# EAGLE design e-programmer (EAGLE 6.1)
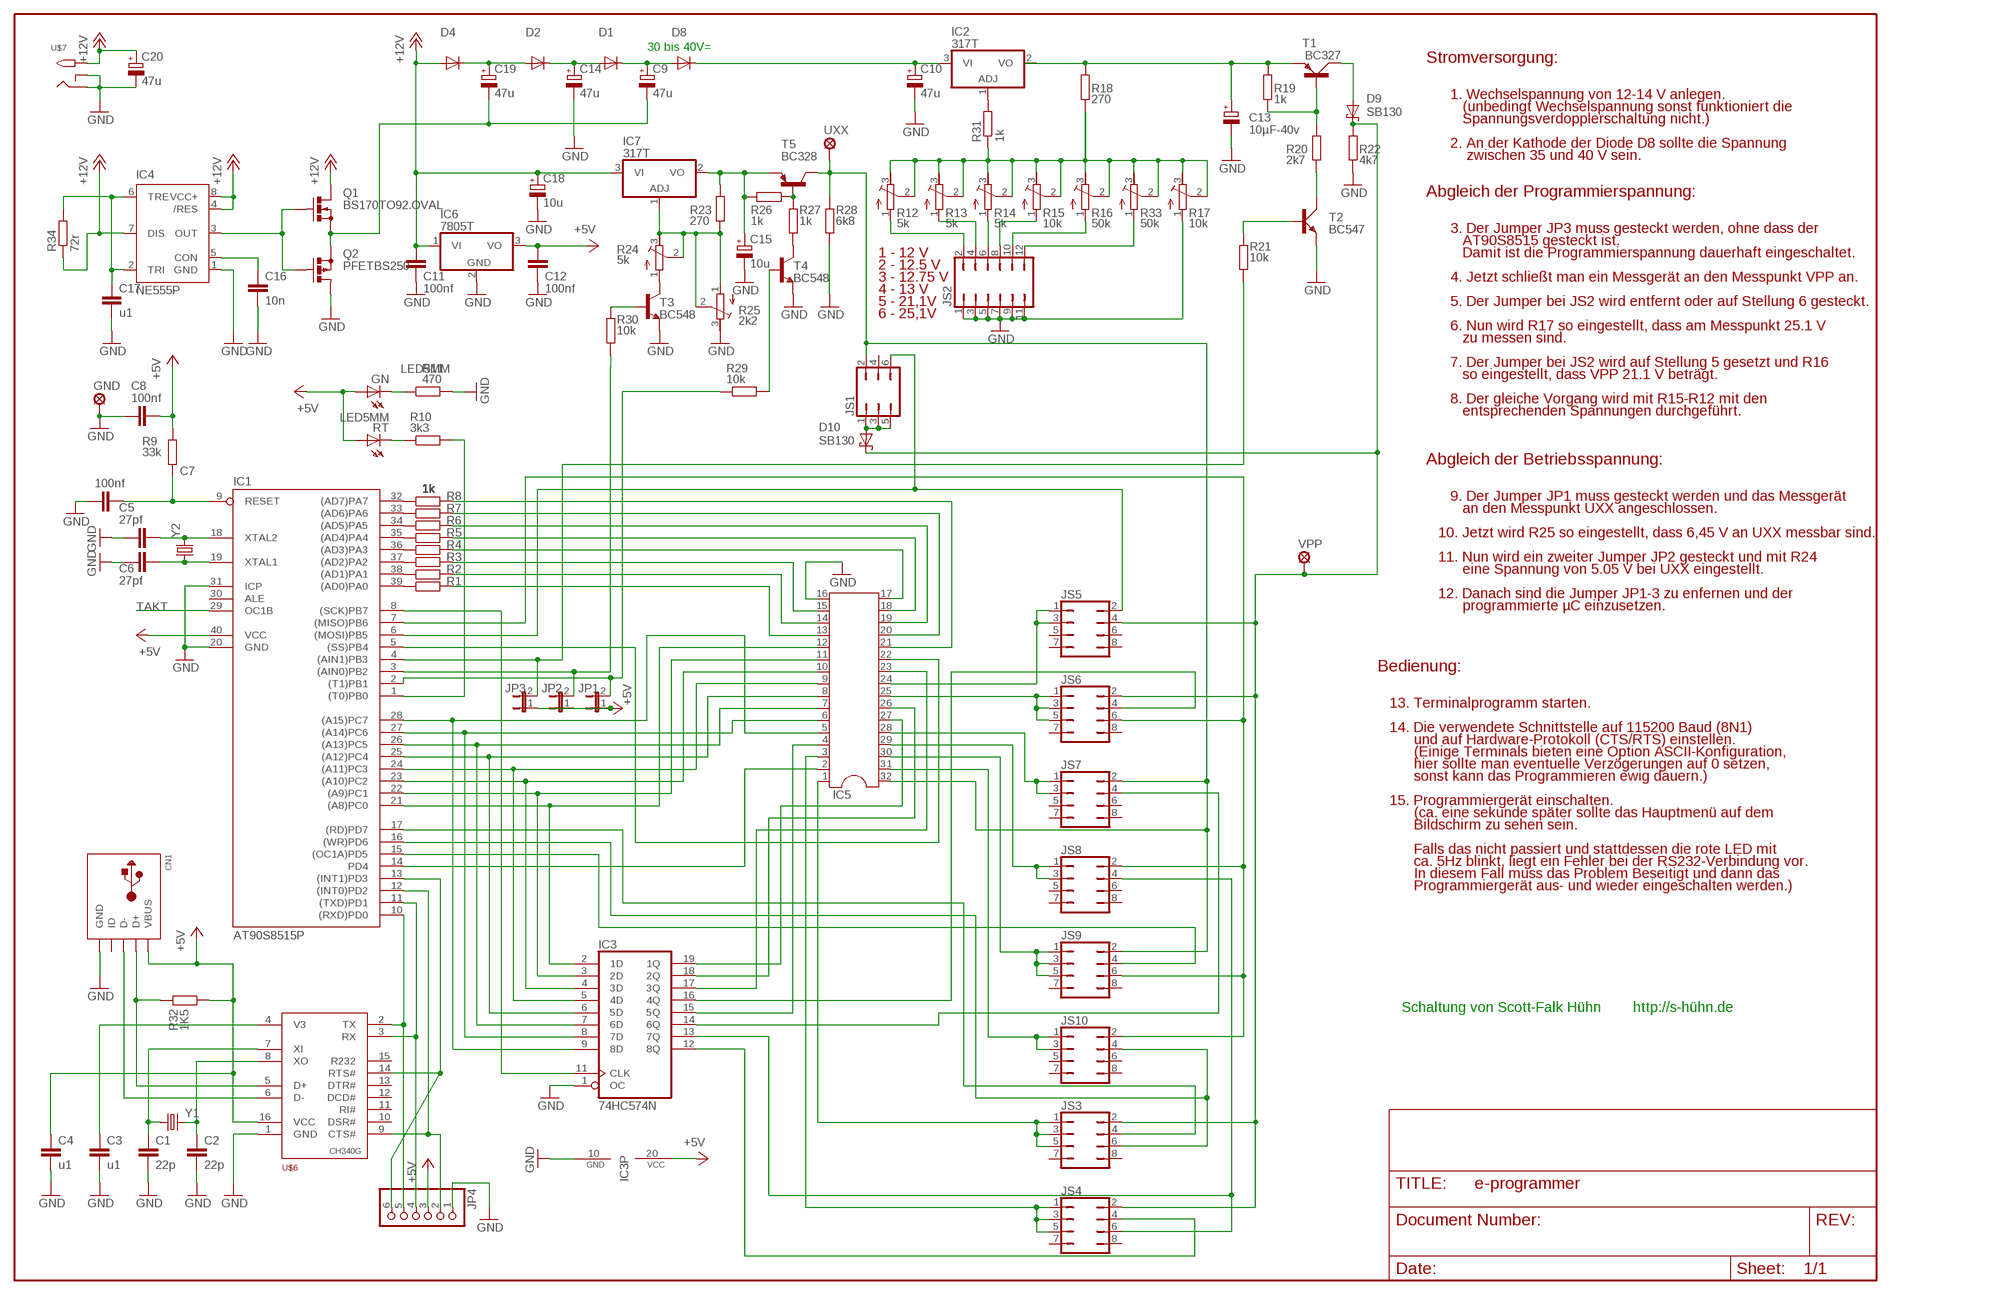
[diagram p0: schematic, sheet 1]

## Parts
C1  22p  C-EU025-025X050  [C025-025X050]
C2  22p  C-EU025-025X050  [C025-025X050]
C3  u1  C-EU025-025X050  [C025-025X050]
C4  u1  C-EU025-025X050  [C025-025X050]
C5  27pf  C-EU025-024X044  [C025-024X044]
C6  27pf  C-EU025-024X044  [C025-024X044]
C7  100nf  C-EU025-024X044  [C025-024X044]
C8  100nf  C-EU025-024X044  [C025-024X044]
C9  47u  CPOL-EUE2.5-7  [E2,5-7]
C10  47u  CPOL-EUE2.5-7  [E2,5-7]
C11  100nf  C-EU025-024X044  [C025-024X044]
C12  100nf  C-EU025-024X044  [C025-024X044]
C13  10µF-40v  CPOL-EUE2.5-5  [E2,5-5]
C14  47u  CPOL-EUE2.5-7  [E2,5-7]
C15  10u  CPOL-EUE2.5-7  [E2,5-7]
C16  10n  C-EU025-025X050  [C025-025X050]
C17  u1  C-EU025-025X050  [C025-025X050]
C18  10u  CPOL-EUE2.5-7  [E2,5-7]
C19  47u  CPOL-EUE2.5-7  [E2,5-7]
C20  47u  CPOL-EUE2.5-7  [E2,5-7]
CN1  USBTHM  [USB-MINIB-THM]
D1  1N4004  DIODE-DO35-10  [DO35-10]
D2  1N4004  DIODE-DO35-10  [DO35-10]
D4  1N4004  DIODE-DO35-10  [DO35-10]
D8  1N4004  DIODE-DO35-10  [DO35-10]
D9  SB130  SCHOTTKY-DIODEDO35-7  [DO35-7]
D10  SB130  SCHOTTKY-DIODEDO35-7  [DO35-7]
GN  LED5MM  [LED5MM]
GND  LSP10  [LSP10]
IC1  AT90S8515P  [DIL40]
IC2  317T  [TO220H]
IC3  74HC574N  [DIL20]
IC4  NE555P  [DIL-08]
IC5  DIL32  [DIL32]
IC6  7805T  [TO220H]
IC7  317T  [TO220H]
JP1  JP1E  [JP1]
JP2  JP1E  [JP1]
JP3  JP1E  [JP1]
JP4  PINHD-1X6  [1X06]
JS1  JP3Q  [JP3Q]
JS2  JP6Q  [JP6Q]
JS3  JP4Q  [JP4Q]
JS4  JP4Q  [JP4Q]
JS5  JP4Q  [JP4Q]
JS6  JP4Q  [JP4Q]
JS7  JP4Q  [JP4Q]
JS8  JP4Q  [JP4Q]
JS9  JP4Q  [JP4Q]
JS10  JP4Q  [JP4Q]
Q1  BS170TO92.OVAL  [TO92-OVAL]
Q2  PFETBS250  [TO92-OVAL]
R1  1k  R-EU_0207/7  [0207/7]
R2  1k  R-EU_0207/7  [0207/7]
R3  1k  R-EU_0207/7  [0207/7]
R4  1k  R-EU_0207/7  [0207/7]
R5  1k  R-EU_0207/7  [0207/7]
R6  1k  R-EU_0207/7  [0207/7]
R7  1k  R-EU_0207/7  [0207/7]
R8  1k  R-EU_0207/7  [0207/7]
R9  33k  R-EU_0204/7  [0204/7]
R10  3k3  R-EU_0204/7  [0204/7]
R11  470  R-EU_0204/7  [0204/7]
R12  5k  R-TRIMM3296W  [RTRIM3296W]
R13  5k  R-TRIMM3296W  [RTRIM3296W]
R14  5k  R-TRIMM3296W  [RTRIM3296W]
R15  10k  R-TRIMM3296W  [RTRIM3296W]
R16  50k  R-TRIMM3296W  [RTRIM3296W]
R17  10k  R-TRIMM3296W  [RTRIM3296W]
R18  270  R-EU_0207/7  [0207/7]
R19  1k  R-EU_0207/7  [0207/7]
R20  2k7  R-EU_0207/7  [0207/7]
R21  10k  R-EU_0207/7  [0207/7]
R22  4k7  R-EU_0207/7  [0207/7]
R23  270  R-EU_0207/7  [0207/7]
R24  5k  R-TRIMM3296W  [RTRIM3296W]
R25  2k2  R-TRIMM3296W  [RTRIM3296W]
R26  1k  R-EU_0207/7  [0207/7]
R27  1k  R-EU_0207/7  [0207/7]
R28  6k8  R-EU_0207/7  [0207/7]
R29  10k  R-EU_0207/7  [0207/7]
R30  10k  R-EU_0207/7  [0207/7]
R31  1k  R-EU_0207/7  [0207/7]
R32  1K5  R-EU_0204/7  [0204/7]
R33  50k  R-TRIMM3296W  [RTRIM3296W]
R34  72r  R-EU_0204/7  [0204/7]
RT  LED5MM  [LED5MM]
T1  BC327  [SOT54A]
T2  BC547  [SOT54A]
T3  BC548  BC547  [TO92]
T4  BC548  BC547  [TO92]
T5  BC328  BC327  [TO92]
U$6  CH340G  [SO16]
U$7  2.1MMJACKTHM  [PJ-102A]
UXX  LSP10  [LSP10]
VPP  LSP10  [LSP10]
Y1  CRYSTALHC49US  [HC49US]
Y2  CRYSTALHC49US  [HC49US]

## Nets
!CE: IC1.5((SS)PB4) IC5.22
!OE: IC1.6((MOSI)PB5) JS1.6 JS5.2
!PR: IC1.7((MISO)PB6) JS6.6 JS8.2 JS9.6 JS10.2
+5V: C4.1 C8.2 C12.1 CN1.VBUS GN.A IC1.40(VCC) IC3.20(VCC) IC6.3(VO) JP1.1 JP2.1 JP3.1 JP4.3 R9.2 R32.1 RT.A U$6.16(VCC)
+12V: C11.1 C18.+ C20.+ D4.A IC4.4(/RES) IC4.7(DIS) IC4.8(VCC+) IC6.1(VI) IC7.3(VI) Q1.1(D) R34.1 U$7.TIP
A0: IC1.21((A8)PC0) IC3.2(1D) IC5.12
A1: IC1.22((A9)PC1) IC3.3(2D) IC5.11
A2: IC1.23((A10)PC2) IC3.4(3D) IC5.10
A3: IC1.24((A11)PC3) IC3.5(4D) IC5.9
A4: IC1.25((A12)PC4) IC3.6(5D) IC5.8
A5: IC1.26((A13)PC5) IC3.7(6D) IC5.7
A6: IC1.27((A14)PC6) IC3.8(7D) IC5.6
A7: IC1.28((A15)PC7) IC3.9(8D) IC5.5
A8: IC3.19(1Q) IC5.27
A9: IC3.18(2Q) IC5.26
A10: IC3.17(3Q) IC5.23
A11: IC3.16(4Q) JS6.4
A12: IC3.15(5Q) IC5.4
A13: IC3.14(6Q) JS7.4
A14: IC3.13(7Q) JS4.6 JS8.4
A15: IC3.12(8Q) JS4.4
A16: IC1.14(PD4) IC5.2
A17: IC1.15((OC1A)PD5) JS9.4
A18: IC1.16((WR)PD6) JS3.6 JS10.4
A19: IC1.17((RD)PD7) JS3.4
CTS: IC1.12((INT0)PD2) JP4.2 U$6.9(CTS#)
D0: IC5.13 R1.2
D1: IC5.14 R2.2
D2: IC5.15 R3.2
D3: IC5.17 R4.2
D4: IC5.18 R5.2
D5: IC5.19 R6.2
D6: IC5.20 R7.2
D7: IC5.21 R8.2
GND: C1.2 C2.2 C3.2 C4.2 C5.1 C6.1 C7.1 C8.1 C10.- C11.2 C12.2 C13.- C14.- C15.- C16.2 C17.2 C18.- C20.- CN1.GND GND.MP IC1.20(GND) IC1.31(ICP) IC3.1(OC) IC3.10(GND) IC4.1(GND) IC5.16 IC6.2(GND) JP4.1 JS2.1 JS2.3 JS2.5 JS2.7 JS2.9 JS2.11 Q2.1(D) R11.2 R17.1(E) R22.1 R25.3(A) R28.1 T2.E T3.1(E) T4.1(E) U$6.1(GND) U$7.RING U$7.RING_SW
N$1: IC1.32((AD7)PA7) R8.1
N$2: IC1.33((AD6)PA6) R7.1
N$3: IC1.34((AD5)PA5) R6.1
N$4: IC1.35((AD4)PA4) R5.1
N$5: IC1.36((AD3)PA3) R4.1
N$6: IC1.37((AD2)PA2) R3.1
N$7: IC1.38((AD1)PA1) R2.1
N$8: IC1.39((AD0)PA0) R1.1
N$9: IC1.8((SCK)PB7) IC3.11(CLK)
N$10: IC1.10((RXD)PD0) JP4.5 U$6.2(TX)
N$11: IC1.11((TXD)PD1) JP4.4 U$6.3(RX)
N$12: CN1.D+ R32.2 U$6.5(D+)
N$13: CN1.D- U$6.6(D-)
N$14: C2.1 U$6.8(XO) Y1.2
N$15: C1.1 U$6.7(XI) Y1.1
N$16: C3.1 U$6.4(V3)
N$17: JS2.12 R33.1(E)
N$18: C10.+ D8.C IC2.3(VI)
N$19: R10.1 RT.K(C)
N$20: C16.1 IC4.5(CON)
N$21: IC4.3(OUT) Q1.2(G) Q2.2(G)
N$22: C17.1 IC4.2(TRI) IC4.6(TRE) R34.2
N$23: C14.+ D1.A D2.C
N$24: C9.- C19.- Q1.3(S) Q2.3(S)
N$25: C9.+ D1.C D8.A
N$26: GN.K(C) R11.1
N$27: IC5.3 JS4.1 JS4.3 JS4.5
N$28: C5.2 IC1.18(XTAL2) Y2.2
N$29: C6.2 IC1.19(XTAL1) Y2.1
N$30: IC5.1 JS3.1 JS3.3 JS3.5
N$31: IC5.24 JS5.1 JS5.3
N$32: C7.2 IC1.9(RESET) R9.1
N$34: IC5.25 JS6.1 JS6.3 JS6.5
N$35: JS2.2 R12.1(E)
N$36: JS2.4 R13.1(E)
N$37: IC5.28 JS7.1 JS7.3
N$38: IC5.29 JS8.1 JS8.3
N$41: IC1.1((T0)PB0) R10.2
N$42: IC5.30 JS9.1 JS9.3 JS9.5
N$44: JS2.6 R14.1(E)
N$45: IC5.31 JS10.1 JS10.3
N$47: JS2.8 R15.1(E)
N$48: JS2.10 R16.1(E)
N$49: R12.2(S) R12.3(A) R13.2(S) R13.3(A) R14.2(S) R14.3(A) R15.2(S) R15.3(A) R16.2(S) R16.3(A) R17.2(S) R17.3(A) R18.1 R31.1 R33.2(S) R33.3(A)
N$50: D10.A JS1.1 JS1.3 JS1.5
N$51: D9.A T1.C
N$52: R26.1 R27.2 T5.2(B)
N$53: R27.1 T4.3(C)
N$55: IC7.1(ADJ) R23.1 R24.2(S) R24.3(A) R25.1(E) R25.2(S)
N$56: R24.1(E) T3.3(C)
N$57: C15.+ IC7.2(VO) R23.2 R26.2 T5.1(E)
N$60: R29.2 T4.2(B)
N$61: C13.+ IC2.2(VO) R18.2 R19.2 T1.E
N$62: R30.2 T3.2(B)
N$65: C19.+ D2.A D4.C
N$68: R19.1 R20.2 T1.B
N$69: R20.1 T2.C
N$70: R21.2 T2.B
N$71: IC2.1(ADJ) R31.2
RTS: IC1.13((INT1)PD3) JP4.6 U$6.14(RTS#)
TAKT: IC1.29(OC1B)
UXX: IC5.32 JS1.2 JS7.2 JS9.2 R28.2 T5.3(C) UXX.MP
VCC_5/6: IC1.3((AIN0)PB2) JP2.2 R30.1
VCC_EIN: IC1.2((T1)PB1) JP1.2 R29.1
VPP: D9.C D10.C JS3.2 JS4.2 JS5.4 JS6.2 R22.2 VPP.MP
VPP_EIN: IC1.4((AIN1)PB3) JP3.2 R21.1
Unconnected: CN1.ID IC1.30(ALE) JS1.4 JS3.7 JS3.8 JS4.7 JS4.8 JS5.5 JS5.6 JS5.7 JS5.8 JS6.7 JS6.8 JS7.5 JS7.6 JS7.7 JS7.8 JS8.5 JS8.6 JS8.7 JS8.8 JS9.7 JS9.8 JS10.5 JS10.6 JS10.7 JS10.8 U$6.10(DSR#) U$6.11(RI#) U$6.12(DCD#) U$6.13(DTR#) U$6.15(R232)

## Notes on the sheet
- 30 bis 40V=
- Stromversorgung:
- 1. Wechselspannung von 12-14 V anlegen.
- (unbedingt Wechselspannung sonst funktioniert die
- Spannungsverdopplerschaltung nicht.)
- 2. An der Kathode der Diode D8 sollte die Spannung
- zwischen 35 und 40 V sein.
- Abgleich der Programmierspannung:
- 3. Der Jumper JP3 muss gesteckt werden, ohne dass der
- AT90S8515 gesteckt ist.
- 1 - 12 V | Damit ist die Programmierspannung dauerhaft eingeschaltet.
- 2 - 12.5 V
- 3 - 12.75 V | 4. Jetzt schließt man ein Messgerät an den Messpunkt VPP an.
- 4 - 13 V
- 5 - 21,1V | 5. Der Jumper bei JS2 wird entfernt oder auf Stellung 6 gesteckt.
- 6 - 25,1V
- 6. Nun wird R17 so eingestellt, dass am Messpunkt 25.1 V
- zu messen sind.
- 7. Der Jumper bei JS2 wird auf Stellung 5 gesetzt und R16
- so eingestellt, dass VPP 21.1 V beträgt.
- 8. Der gleiche Vorgang wird mit R15-R12 mit den
- entsprechenden Spannungen durchgeführt.
- Abgleich der Betriebsspannung:
- 9. Der Jumper JP1 muss gesteckt werden und das Messgerät
- an den Messpunkt UXX angeschlossen.
- 10. Jetzt wird R25 so eingestellt, dass 6,45 V an UXX messbar sind.
- 11. Nun wird ein zweiter Jumper JP2 gesteckt und mit R24
- eine Spannung von 5.05 V bei UXX eingestellt.
- 12. Danach sind die Jumper JP1-3 zu enfernen und der
- programmierte µC einzusetzen.
- Bedienung:
- 13. Terminalprogramm starten.
- 14. Die verwendete Schnittstelle auf 115200 Baud (8N1)
- und auf Hardware-Protokoll (CTS/RTS) einstellen.
- (Einige Terminals bieten eine Option ASCII-Konfiguration,
- hier sollte man eventuelle Verzögerungen auf 0 setzen,
- sonst kann das Programmieren ewig dauern.)
- 15. Programmiergerät einschalten.
- (ca. eine sekunde später sollte das Hauptmenü auf dem
- Bildschirm zu sehen sein.
- Falls das nicht passiert und stattdessen die rote LED mit
- ca. 5Hz blinkt, liegt ein Fehler bei der RS232-Verbindung vor.
- In diesem Fall muss das Problem Beseitigt und dann das
- Programmiergerät aus- und wieder eingeschalten werden.)
- Schaltung von Scott-Falk Hühn | http://s-hühn.de

## Library data of the parts
C1-C8 C11 C12 C16 C17 = rcl:C-EU: CAPACITOR, European symbol
C9 C10 C13-C15 C18-C20 = rcl:CPOL-EU: POLARIZED CAPACITOR, European symbol
CN1 = adafruit:USB: USB Connectors USBMINIB - Surface Mount Female Mini-B USB Connector 4UConnector: 06564 By microbuilder.eu Thru-hole RA Female Mini-B USB Connector 4UConnector: 18732 By ladyada.net
D1 D2 D4 D8 = diode:DIODE-: DIODE
D9 D10 = diode:SCHOTTKY-DIODE: Schottky Diode
GN RT = led:LED5MM: LED 5 mm, round
GND UXX VPP = solpad:LSP10: SOLDER PAD drill 1.0 mm, distributor Buerklin, 12H555
IC1 = atmel:AT90S8515P: MICROCONTROLLER 8 Kbytes FLASH 512 bytes SRAM 512 bytes EEPROM UART
IC2 IC7 = linear:*317: Positive VOLTAGE REGULATOR
IC3 = 74xx-us:74*574: 8-bit D type FLIP FLOP bus driver
IC4 = SparkFun-AnalogIC:NE555: General purpose bipolar Timer; MF: Arrow Electronics; MPN: NE555N; OC_FARNELL: 1467742; OC_NEWARK: 89K1486
IC5 = dil:DIL32: SOCKET Dual In Line
IC6 = linear:78*: Positive VOLTAGE REGULATOR
JP1-JP3 = jumper:JP1E: JUMPER
JP4 = pinhead:PINHD-1X6: PIN HEADER
JS1 = jumper:JP3Q: JUMPER
JS2 = jumper:JP6Q: JUMPER
JS3-JS10 = jumper:JP4Q: JUMPER
Q1 = _MY_OWN_LIB:BS170: N-CHANNEL MOS FET
Q2 = adafruit_t10:PFET: P-CHANNEL MOS FET
R1-R11 R18-R23 R26-R32 R34 = rcl:R-EU_: RESISTOR, European symbol
R12-R17 R24 R25 R33 = rcl:R-TRIMM: Trimm resistor
T1 = transistor-small-signal:BC327: PNP TRANSISTOR
T2 = transistor-small-signal:BC547: NPN TRANSISTOR
T3 T4 = transistor-npn:BC547: NPN TRANSISTOR
T5 = transistor-pnp:BC327: PNP TRANSISTOR
U$6 = _MY_OWN_LIB:CH340G
U$7 = adafruit:2.1MMJACK: 2.1mm x 5.5mm THM DC jack with internal switch. Digikey part #PJ-102A, 4UCON part #05537 2.1mm x 5.5mm SMT DC jack with internal switch. Digikey part #PJ-002A-SMT, 4UCON part #03267 By microbuilder.eu & adafruit.com
Y1 Y2 = SparkFun-FreqCtrl:CRYSTAL: Various standard crystals. Proven footprints. Spark Fun Electronics SKU : COM-00534

## Board
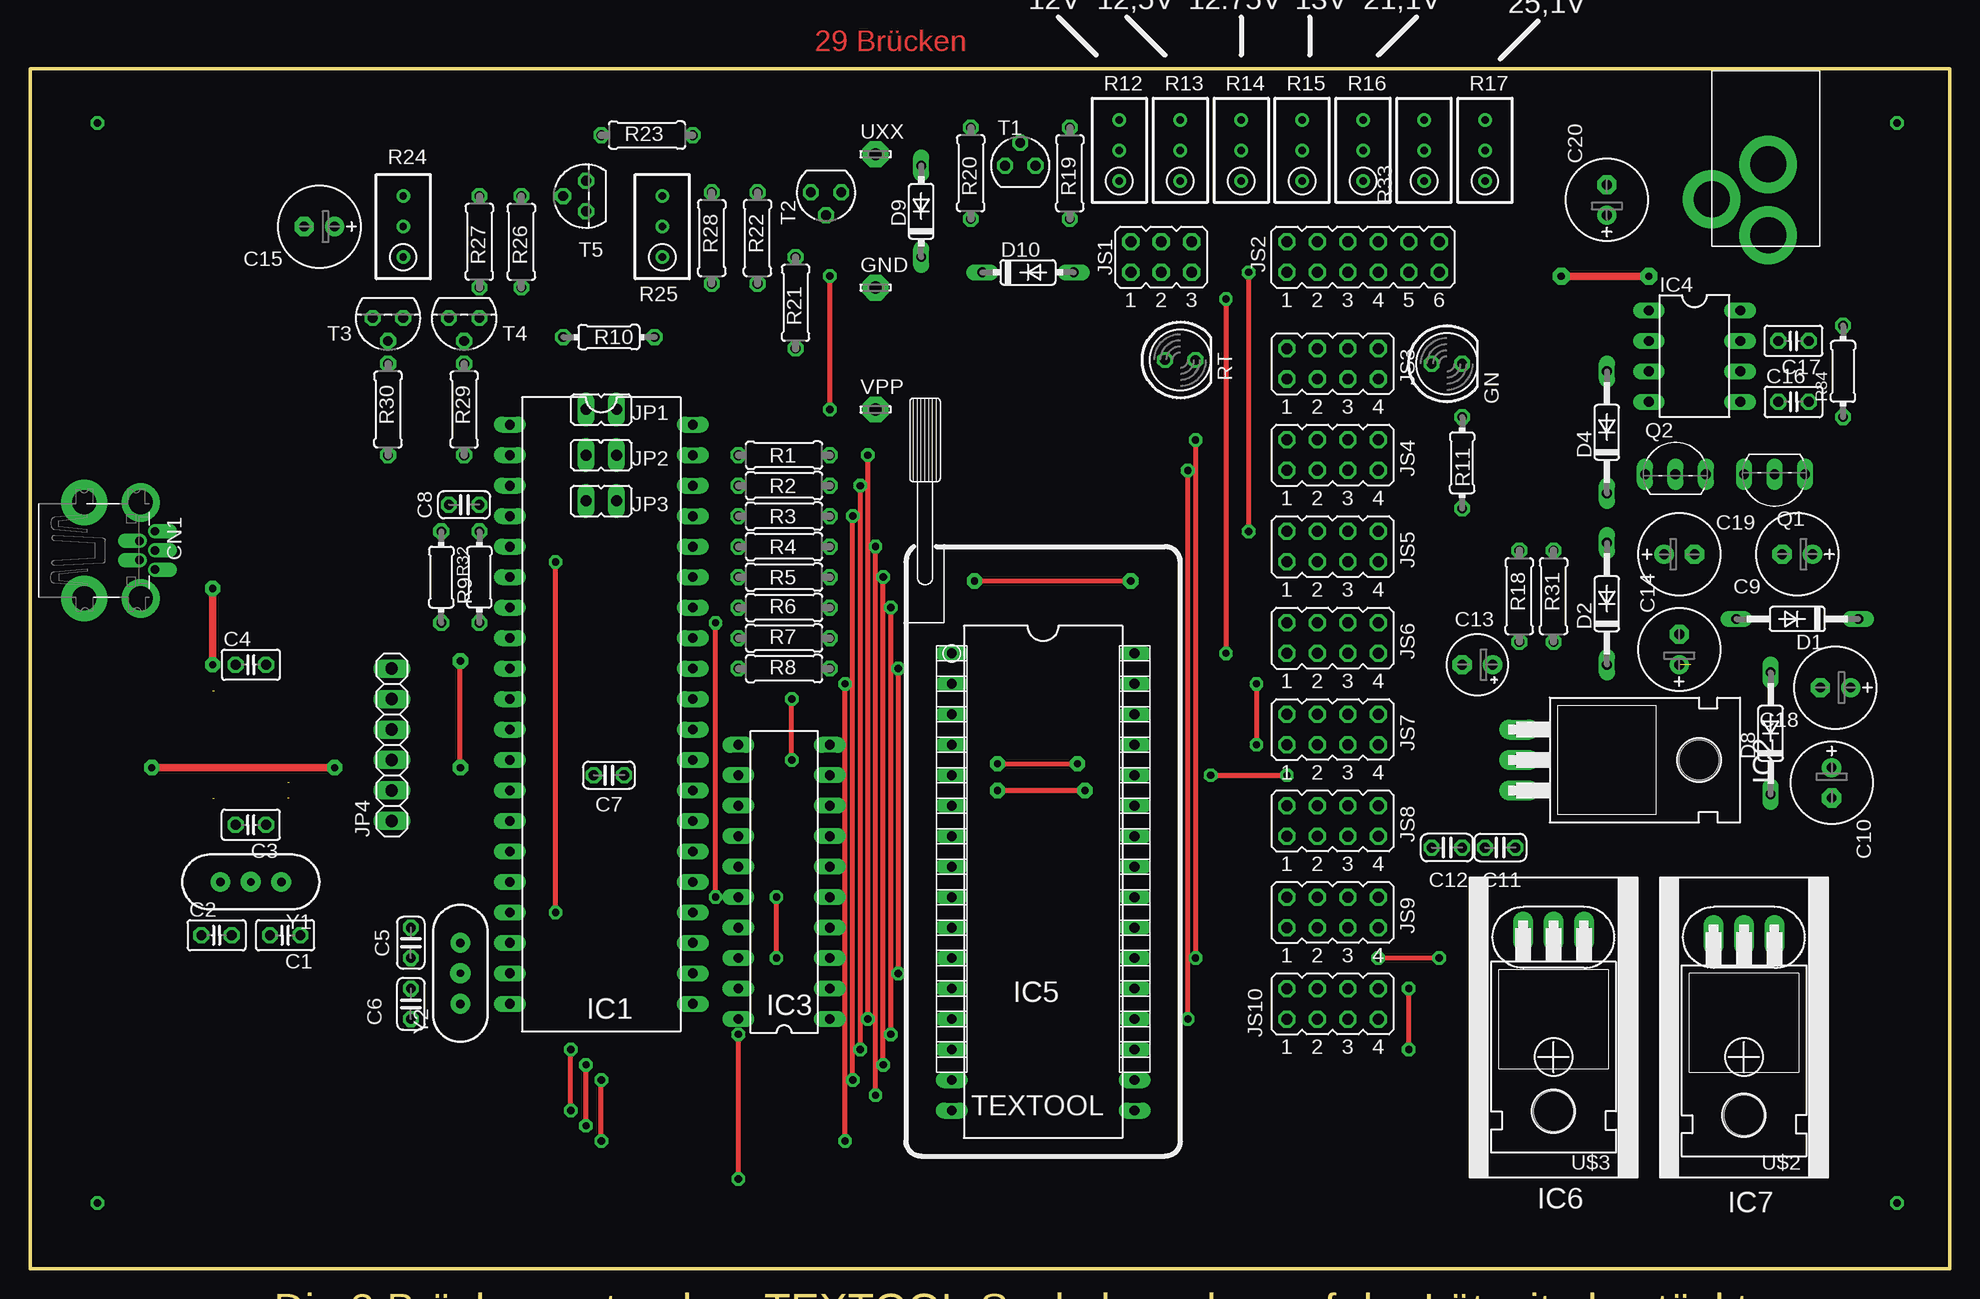
[diagram p1: board, top side]
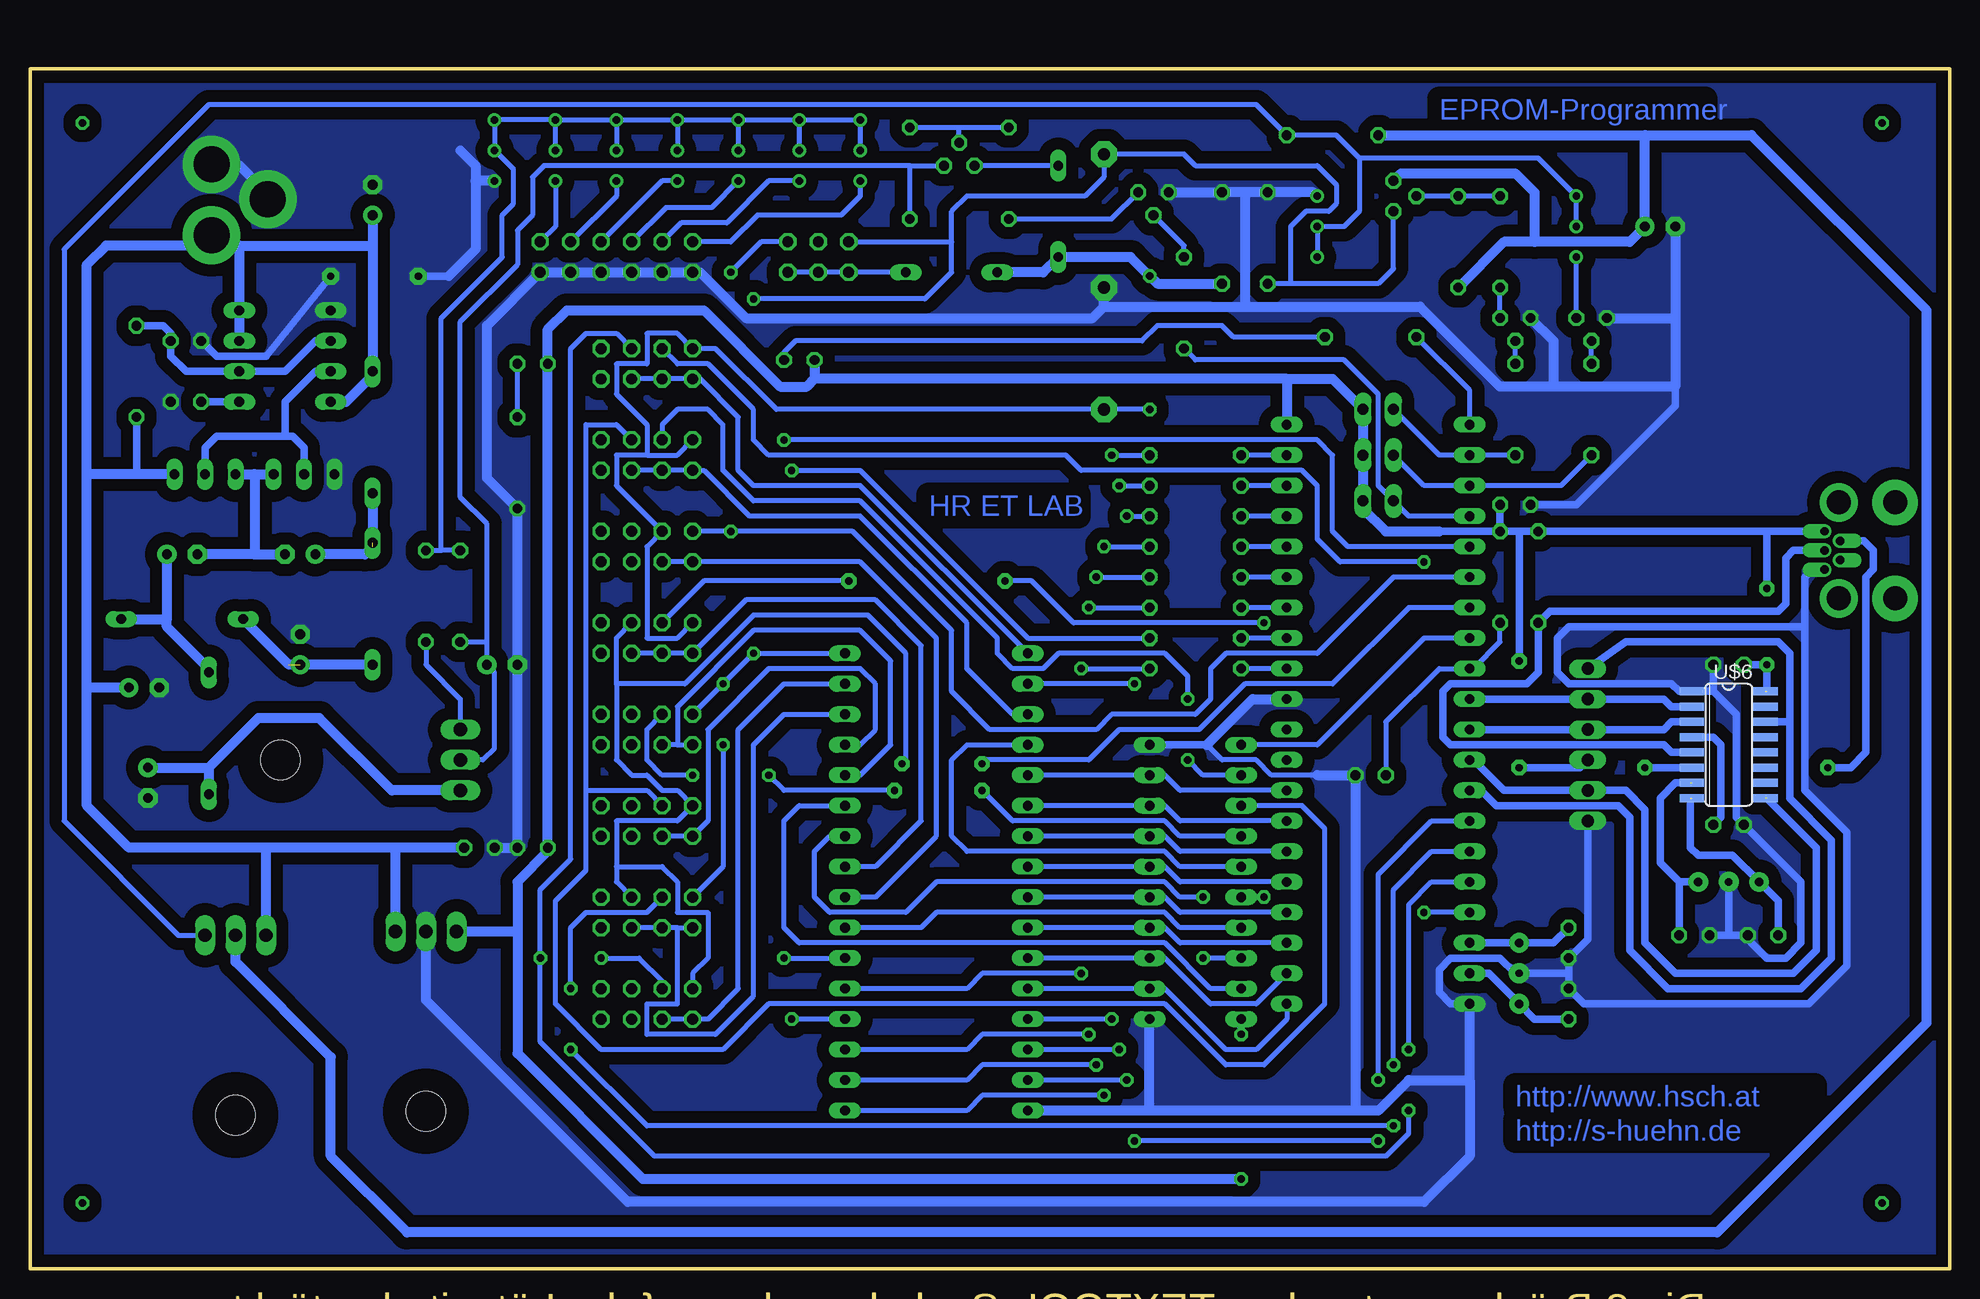
[diagram p2: board, bottom side, seen from below]

Size 160 x 100 mm. Coordinates in mm from the lower left corner, seen from the top.
Outline: 0,0 160,0 160,100 0,100 0,0
Copper layers (1*16): Top 0.035mm / dielectric 1.5mm / Bottom 0.035mm
Design rules: minimum track width 10mil, minimum drill 24mil, track to track 12mil, track to pad 12mil, pad to pad 12mil, via to via 12mil, smd to smd 10mil, copper to edge 12mil, drill to drill 12mil, minimum pad ring 10mil, minimum via ring 10mil, stop-mask expansion 4mil, vias tented up to drill 0mil, thermal gap 12mil

### Footprints (pad centres in the part's own frame; a part is rotated, then mirrored left to right if it is on the bottom)
C025-025X050 = drill 0.813 octagon: 1 -1.27,0; 2 1.27,0
C025-024X044 = drill 0.813 octagon: 1 -1.27,0; 2 1.27,0
E2,5-7 = drill 0.813 pad 1.6: + -1.27,0 | drill 0.813 pad 1.6 octagon: - 1.27,0
E2,5-5 = drill 0.813 pad 1.6: + -1.27,0 | drill 0.813 pad 1.6 octagon: - 1.27,0
USB-MINIB-THM = drill 0.7 offset: D+ 0,9.8; D- -0.8,8.5; GND 1.6,9.8; ID 0.8,8.5; VBUS -1.6,9.8 | drill 2 pad 3.81: GND1 -4,3.9; GND4 4,3.9 | drill 2 pad 3.2: GND2 -4,8.6; GND3 4,8.6
DO35-10 = drill 0.813 long: A 5.08,0; C -5.08,0
DO35-7 = drill 0.813 long: A 3.81,0; C -3.81,0
LED5MM = drill 0.813 octagon: A -1.27,0; K 1.27,0
LSP10 = drill 1.016 pad 2.159 octagon: MP 0,0
DIL40 = drill 0.813 long: 1 -24.13,-7.62; 2 -21.59,-7.62; 3 -19.05,-7.62; 4 -16.51,-7.62; 5 -13.97,-7.62; 6 -11.43,-7.62; 7 -8.89,-7.62; 8 -6.35,-7.62; 9 -3.81,-7.62; 10 -1.27,-7.62; 11 1.27,-7.62; 12 3.81,-7.62; 13 6.35,-7.62; 14 8.89,-7.62; 15 11.43,-7.62; 16 13.97,-7.62; 17 16.51,-7.62; 18 19.05,-7.62; 19 21.59,-7.62; 20 24.13,-7.62; 21 24.13,7.62; 22 21.59,7.62; 23 19.05,7.62; 24 16.51,7.62; 25 13.97,7.62; 26 11.43,7.62; 27 8.89,7.62; 28 6.35,7.62; 29 3.81,7.62; 30 1.27,7.62; 31 -1.27,7.62; 32 -3.81,7.62; 33 -6.35,7.62; 34 -8.89,7.62; 35 -11.43,7.62; 36 -13.97,7.62; 37 -16.51,7.62; 38 -19.05,7.62; 39 -21.59,7.62; 40 -24.13,7.62
TO220H = drill 1.118 long: 1 -2.54,-10.16; 2 0,-10.16; 3 2.54,-10.16 | hole 3.302: 0,4.826
DIL20 = drill 0.813 long: 1 -11.43,-3.81; 2 -8.89,-3.81; 3 -6.35,-3.81; 4 -3.81,-3.81; 5 -1.27,-3.81; 6 1.27,-3.81; 7 3.81,-3.81; 8 6.35,-3.81; 9 8.89,-3.81; 10 11.43,-3.81; 11 11.43,3.81; 12 8.89,3.81; 13 6.35,3.81; 14 3.81,3.81; 15 1.27,3.81; 16 -1.27,3.81; 17 -3.81,3.81; 18 -6.35,3.81; 19 -8.89,3.81; 20 -11.43,3.81
DIL-08 = drill 0.813 long: 1 -3.81,-3.81; 2 -1.27,-3.81; 3 1.27,-3.81; 4 3.81,-3.81; 5 3.81,3.81; 6 1.27,3.81; 7 -1.27,3.81; 8 -3.81,3.81
DIL32 = drill 0.813 long: 1 -19.05,-7.62; 2 -16.51,-7.62; 3 -13.97,-7.62; 4 -11.43,-7.62; 5 -8.89,-7.62; 6 -6.35,-7.62; 7 -3.81,-7.62; 8 -1.27,-7.62; 9 1.27,-7.62; 10 3.81,-7.62; 11 6.35,-7.62; 12 8.89,-7.62; 13 11.43,-7.62; 14 13.97,-7.62; 15 16.51,-7.62; 16 19.05,-7.62; 17 19.05,7.62; 18 16.51,7.62; 19 13.97,7.62; 20 11.43,7.62; 21 8.89,7.62; 22 6.35,7.62; 23 3.81,7.62; 24 1.27,7.62; 25 -1.27,7.62; 26 -3.81,7.62; 27 -6.35,7.62; 28 -8.89,7.62; 29 -11.43,7.62; 30 -13.97,7.62; 31 -16.51,7.62; 32 -19.05,7.62
JP1 = drill 0.914 long: 1 0,-1.27; 2 0,1.27
1X06 = drill 1.016 long: 1 -6.35,0; 2 -3.81,0; 3 -1.27,0; 4 1.27,0; 5 3.81,0; 6 6.35,0
JP3Q = drill 0.914 octagon: 1 -2.54,-1.27; 2 -2.54,1.27; 3 0,-1.27; 4 0,1.27; 5 2.54,-1.27; 6 2.54,1.27
JP6Q = drill 0.914 octagon: 1 -6.35,-1.27; 2 -6.35,1.27; 3 -3.81,-1.27; 4 -3.81,1.27; 5 -1.27,-1.27; 6 -1.27,1.27; 7 1.27,-1.27; 8 1.27,1.27; 9 3.81,-1.27; 10 3.81,1.27; 11 6.35,-1.27; 12 6.35,1.27
JP4Q = drill 0.914 octagon: 1 -3.81,-1.27; 2 -3.81,1.27; 3 -1.27,-1.27; 4 -1.27,1.27; 5 1.27,-1.27; 6 1.27,1.27; 7 3.81,-1.27; 8 3.81,1.27
TO92-OVAL = drill 0.813 long: 1 -2.54,0; 2 0,0; 3 2.54,0
0207/7 = drill 0.813 octagon: 1 -3.81,0; 2 3.81,0
0204/7 = drill 0.813 octagon: 1 -3.81,0; 2 3.81,0
RTRIM3296W = drill 0.61: 1 0,-2.54; 2 0,0; 3 0,2.54
SOT54A = drill 0.813 octagon: B 0,1.905; C -1.27,0; E 1.27,0
TO92 = drill 0.813 octagon: 1 1.27,0; 2 0,1.905; 3 -1.27,0
SO16 = smd 2.032 x 0.66: 1 -0.533,6.985; 2 -0.533,5.715; 3 -0.533,4.445; 4 -0.533,3.175; 5 -0.533,1.905; 6 -0.533,0.635; 7 -0.533,-0.635; 8 -0.533,-1.905; 9 5.613,-1.905; 10 5.613,-0.635; 11 5.613,0.635; 12 5.613,1.905; 13 5.613,3.175; 14 5.613,4.445; 15 5.613,5.715; 16 5.613,6.985
PJ-102A = drill 3 pad 4.8: RING 0.1,-3.39; RING_SW -4.6,-6.29; TIP 0.1,-9.29
HC49US = drill 0.7 pad 1.651: 1 -2.54,0; 2 2.54,0

### Placement (x,y rotation side)
C1  21.27,27.77 180 top
C2  15.55,27.77 0 top
C3  18.41,36.98 180 top
C4  18.41,50.32 0 top
C5  31.74,27.14 90 top
C6  31.74,22.06 270 top
C7  48.26,41.11 180 top
C8  36.19,63.65 0 top
C9  147.31,59.52 180 top
C10  150.17,40.48 270 top
C11  122.55,35.08 180 top
C12  118.1,35.08 0 top
C13  120.64,50.32 180 top
C14  137.47,51.59 90 top
C15  24.12,86.83 180 top
C16  147,72.22 0 top
C17  147,77.3 180 top
C18  150.49,48.41 180 top
C19  137.47,59.52 0 top
C20  131.44,89.05 90 top
CN1  0.63,59.84 270 top
D1  147.31,54.13 180 top
D2  131.44,55.4 90 top
D4  131.44,69.69 90 top
D8  145.09,44.6 90 top
D9  74.29,88.1 90 top
D10  83.18,83.02 0 top
GN  118.1,75.4 0 top
GND  70.48,81.75 0 top
IC1  47.62,46.19 270 top
IC2  134.3,42.38 270 top
IC3  62.86,32.22 90 top
IC4  138.74,76.03 270 top
IC5  84.45,32.22 270 top
IC6  126.99,17.93 180 top
IC7  142.87,17.61 180 top
JP1  47.62,71.59 90 top
JP2  47.62,67.78 90 top
JP3  47.62,63.97 90 top
JP4  30.16,43.65 90 top
JS1  94.29,84.29 0 top
JS2  111.12,84.29 0 top
JS3  108.58,75.4 0 top
JS4  108.58,67.78 0 top
JS5  108.58,60.16 0 top
JS6  108.58,52.54 0 top
JS7  108.58,44.92 0 top
JS8  108.58,37.3 0 top
JS9  108.58,29.68 0 top
JS10  108.58,22.06 0 top
Q1  145.41,66.19 180 top
Q2  137.16,66.19 0 top
R1  62.86,67.78 0 top
R2  62.86,65.24 0 top
R3  62.86,62.7 0 top
R4  62.86,60.16 0 top
R5  62.86,57.62 0 top
R6  62.86,55.08 0 top
R7  62.86,52.54 0 top
R8  62.86,50 0 top
R9  37.46,57.62 90 top
R10  48.26,77.62 180 top
R11  119.38,67.14 270 top
R12  90.8,93.18 0 top
R13  95.88,93.18 0 top
R14  100.96,93.18 0 top
R15  106.04,93.18 0 top
R16  111.12,93.18 0 top
R17  121.28,93.18 0 top
R18  124.14,56.03 270 top
R19  86.67,91.28 270 top
R20  78.42,91.28 90 top
R21  63.81,80.48 90 top
R22  60.64,85.88 270 top
R23  51.43,94.45 180 top
R24  31.11,86.83 0 top
R25  52.7,86.83 0 top
R26  40.95,85.56 270 top
R27  37.46,85.56 90 top
R28  56.83,85.88 270 top
R29  36.19,71.59 90 top
R30  29.84,71.59 90 top
R31  126.99,56.03 270 top
R32  34.29,57.62 270 top
R33  116.2,93.18 0 top
R34  151.12,74.77 90 top
RT  95.88,75.72 0 top
T1  82.55,91.91 0 top
T2  66.35,89.69 180 top
T3  29.84,79.21 180 top
T4  36.19,79.21 180 top
T5  46.35,89.37 90 top
U$1  [SOCKEL]  84.45,33.49 180 top
U$2  [SK12/25]  142.87,22.7 90 top
U$3  [SK12/25]  126.99,22.7 90 top
U$4  [LETTER_P]  203.83,-49.06 90 top  (outside the outline)
U$5  [DOCFIELD]  102.23,-49.06 0 top  (outside the outline)
U$6  20.95,41.11 0 bottom
U$7  144.78,95.4 0 top
UXX  70.48,92.86 0 top
VPP  70.48,71.59 0 top
Y1  18.41,32.22 180 top
Y2  35.87,24.6 90 top

### Tracks (layer width: path | path; a pad name or v marks a point on that pad's centre or on a via)
!CE  (via drill 0.61)
  Top 0.406: v97.15,69.05 v97.15,25.87
  Bottom 0.406: v97.15,69.05 52.7,69.05 51.43,67.78 51.43,61.43 50.16,60.16 IC1.5 | v97.15,25.87 IC5.22
!OE  (via drill 0.61)
  Top 0.406: v101.59,61.43 v101.59,83.02
  Bottom 0.406: JS5.2 v101.59,61.43 91.44,61.43 83.18,53.17 83.18,48.09 80,44.92 71.11,44.92 69.84,46.19 62.86,46.19 61.59,47.46 61.59,50 60.32,51.27 52.7,51.27 46.35,57.62 IC1.6 | JS1.6 99.05,85.56 v101.59,83.02
!PR  (via drill 0.61 pad 1.27)
  Top 0.406: v80.64,42.06 v87.31,42.06
  Bottom 0.406: JS9.6 111.12,32.22 111.12,33.49 | 111.12,33.49 111.12,37.3 106.04,37.3 JS8.2 106.04,39.84 107.31,39.84 108.58,41.11 109.85,41.11 111.12,42.38 111.12,48.73 | JS6.6 111.12,52.54 111.12,48.73 | JS10.2 104.77,24.6 103.5,25.87 103.5,29.68 106.04,29.68 106.04,32.22 107.31,33.49 111.12,33.49 | 111.12,48.73 105.41,48.73 99.69,54.45 90.16,54.45 86.99,51.27 86.99,42.38 v87.31,42.06 | IC1.7 45.08,55.08 51.43,48.73 58.73,48.73 62.54,44.92 69.21,44.92 71.75,42.38 80.32,42.38 v80.64,42.06
+5V  (via drill 0.6 pad 1.27, 0.61)  (1 unrouted)
  Top 0.406: v59.05,7.46 v59.05,19.52 | v35.87,41.74 v35.87,50.63
  Top 0.61: v15.24,56.67 v15.24,50.32
  Bottom 0.61: 42.54,61.43 R9.2 | R9.2 35.87,61.43 | v35.87,41.74 30.79,41.74 JP4.3 | v35.87,50.63 35.87,61.43 | CN1.VBUS 10.44,61.43 15.24,61.43 | IC3.20 v59.05,19.52 | v15.24,56.67 15.24,61.43 | C8.2 R9.2 | 15.24,48.09 v15.24,50.32 C4.1 | 15.24,61.43 R32.1 35.87,61.43
  Bottom 0.813: 55.24,74.13 51.43,74.13 JP1.1 JP2.1 JP3.1 48.89,63.34 46.98,61.43 42.54,61.43 | 55.24,74.13 IC1.40 | v59.05,7.46 108.9,7.46 119.38,17.93 119.38,28.09 | 55.24,74.13 94.61,74.13 | RT.A 94.61,74.13 | 94.61,74.13 95.24,73.5 97.47,73.5 103.82,79.84 115.25,79.84 116.83,78.26 GN.A C12.1 116.83,34.76 119.38,32.22 119.38,28.09 | IC6.3 119.38,28.09
+12V
  Bottom 0.61: R34.1 151.12,66.19
  Bottom 0.813: 129.53,35.08 140.33,35.08 | IC7.3 140.33,35.08 | IC6.1 129.53,35.08 | C11.1 129.53,35.08 | 140.33,35.08 151.76,35.08 155.25,38.57 155.25,48.41 | 155.25,48.41 155.25,66.19 | 155.25,66.19 155.25,83.66 153.66,85.24 144.78,85.24 | IC4.7 IC4.8 142.55,85.24 | Q1.1 151.12,66.19 155.25,66.19 | C18.+ 155.25,48.41 | 142.55,85.24 131.44,85.24 | 131.44,85.24 D4.A 131.44,74.45 133.66,72.22 IC4.4 | 142.55,85.24 144.78,85.24 | U$7.TIP 144.88,85.34 144.78,85.24 | C20.+ 131.44,85.24
A0
  Bottom 0.406: IC5.12 IC3.2 65.4,23.33 60.32,18.25 57.78,18.25 55.24,20.79 IC1.21
A1
  Bottom 0.406: IC1.22 57.78,22.06 61.59,22.06 65.4,25.87 IC3.3 IC5.11
A2
  Bottom 0.406: IC1.23 64.13,27.14 65.4,28.41 IC3.4 IC5.10
A3
  Bottom 0.406: IC1.24 64.13,29.68 65.4,30.95 IC3.5 IC5.9
A4
  Bottom 0.406: IC1.25 64.13,32.22 65.4,33.49 IC3.6 IC5.8
A5
  Bottom 0.406: IC1.26 64.13,34.76 65.4,36.03 IC3.7 IC5.7
A6
  Bottom 0.406: IC1.27 64.13,37.3 65.4,38.57 IC3.8 IC5.6
A7
  Bottom 0.406: IC1.28 64.13,39.84 65.4,41.11 IC3.9 IC5.5
A8
  Bottom 0.406: IC3.19 61.59,23.33 65.4,27.14 95.88,27.14 97.15,28.41 97.15,37.3 95.88,38.57 IC5.27
A9  (via drill 0.61)
  Top 0.406: v62.23,25.87 v62.23,30.95
  Bottom 0.406: IC5.26 93.34,36.03 94.61,34.76 94.61,30.95 93.34,29.68 86.99,29.68 84.45,32.22 65.4,32.22 64.13,30.95 v62.23,30.95 | IC3.18 v62.23,25.87
A10
  Bottom 0.406: IC3.17 64.13,28.41 65.4,29.68 84.45,29.68 85.72,28.41 IC5.23
A11  (via drill 0.61, 0.61 pad 1.27)
  Top 0.406: v78.73,57.3 v91.75,57.3 | v57.15,30.95 v57.15,53.81
  Bottom 0.406: v91.75,57.3 103.82,57.3 JS6.4 | v78.73,57.3 76.51,57.3 73.02,53.81 v57.15,53.81 | v57.15,30.95 IC3.16
A12
  Bottom 0.406: IC3.15 64.13,33.49 65.4,34.76 81.91,34.76 83.18,36.03 83.18,42.38 81.91,43.65 IC5.4
A13  (via drill 0.61, 0.61 pad 1.27)
  Top 0.406: v80.64,39.84 v87.94,39.84 | v98.42,41.11 v104.77,41.11
  Bottom 0.406: IC3.14 64.13,36.03 65.4,37.3 78.1,37.3 v80.64,39.84 | v87.94,39.84 97.15,39.84 v98.42,41.11 | v104.77,41.11 107.31,41.11 108.58,42.38 108.58,44.92 JS7.4
A14
  Bottom 0.406: 113.66,39.84 113.66,33.17 116.2,30.63 116.2,22.06 112.39,18.25 102.23,18.25 98.42,22.06 65.4,22.06 60.32,16.98 57.15,16.98 52.07,22.06 52.07,36.66 53.97,38.57 IC3.13 | 113.66,39.84 108.58,39.84 JS8.4 | JS4.6 111.12,70.32 113.66,70.32 113.66,39.84
A15  (via drill 0.61)
  Top 0.406: v63.5,42.38 v63.5,47.46
  Bottom 0.406: JS4.4 107.31,70.32 106.04,71.59 103.5,71.59 102.23,70.32 102.23,66.51 99.69,63.97 90.8,63.97 79.37,52.54 79.37,51.27 78.1,50 75.56,50 74.29,51.27 65.4,51.27 63.5,49.37 v63.5,47.46 | IC3.12 62.23,41.11 v63.5,42.38
A16  (via drill 0.61)
  Top 0.406: v47.62,10.63 v47.62,15.71 | v67.94,10.63 v67.94,48.73
  Bottom 0.406: v47.62,15.71 47.62,32.85 43.18,37.3 IC1.14 | v47.62,10.63 v67.94,10.63 | v67.94,48.73 IC5.2
A17  (via drill 0.61)
  Top 0.406: v46.35,11.9 v46.35,16.98 | v114.93,18.25 v114.93,23.33
  Bottom 0.406: IC1.15 43.18,34.76 46.35,31.58 v46.35,16.98 | JS9.4 108.58,29.68 113.66,29.68 114.93,28.41 v114.93,23.33 | v114.93,18.25 108.58,11.9 v46.35,11.9
A18  (via drill 0.61)
  Top 0.406: v117.47,25.87 v112.39,25.87 | v45.08,13.17 v45.08,18.25
  Bottom 0.406: JS3.6 111.12,77.94 113.66,77.94 114.93,76.67 114.93,34.12 117.47,31.58 v117.47,25.87 117.47,18.88 107.94,9.36 46.98,9.36 45.08,11.27 v45.08,13.17 | v112.39,25.87 109.21,25.87 107.31,23.96 JS10.4 | IC1.16 43.18,32.22 45.08,30.31 v45.08,18.25
A19  (via drill 0.61)
  Top 0.406: v43.81,29.68 v43.81,58.89
  Bottom 0.406: JS3.4 106.04,75.4 103.5,75.4 99.69,71.59 99.69,69.05 98.42,67.78 73.66,67.78 72.38,66.51 53.97,66.51 52.7,65.24 52.7,60.8 50.8,58.89 v43.81,58.89 | IC1.17 v43.81,29.68
CTS  (1 unrouted)
  Bottom 0.61: IC1.12 39.68,42.38 37.14,39.84 JP4.2 26.98,39.84 25.39,38.25 25.39,27.14 22.86,24.6 13.01,24.6 11.11,26.5 11.11,35.08 15.24,39.2
D0  (via drill 0.61)
  Top 0.406: v69.84,20.79 v69.84,67.78
  Bottom 0.406: v69.84,67.78 R1.2 | v69.84,20.79 IC5.13
D1  (via drill 0.61)
  Top 0.406: v69.21,18.25 v69.21,65.24
  Bottom 0.406: v69.21,18.25 IC5.14 | v69.21,65.24 R2.2
D2  (via drill 0.61)
  Top 0.406: v68.57,15.71 v68.57,62.7
  Bottom 0.406: v68.57,62.7 R3.2 | v68.57,15.71 IC5.15
D3  (via drill 0.61)
  Top 0.406: v70.48,14.44 v70.48,60.16
  Bottom 0.406: v70.48,60.16 R4.2 | v70.48,14.44 80.64,14.44 81.91,13.17 IC5.17
D4  (via drill 0.61)
  Top 0.406: v71.11,16.98 v71.11,57.62
  Bottom 0.406: v71.11,16.98 80.64,16.98 81.91,15.71 IC5.18 | v71.11,57.62 R5.2
D5  (via drill 0.61)
  Top 0.406: v71.75,19.52 v71.75,55.08
  Bottom 0.406: v71.75,55.08 R6.2 | v71.75,19.52 80.64,19.52 81.91,18.25 IC5.19
D6  (via drill 0.61)
  Top 0.406: v96.52,20.79 v96.52,66.51
  Bottom 0.406: IC5.20 v96.52,20.79 | v96.52,66.51 90.8,66.51 76.83,52.54 R7.2
D7  (via drill 0.61)
  Top 0.406: v72.38,24.6 v72.38,50
  Bottom 0.406: v72.38,50 R8.2 | v72.38,24.6 80.64,24.6 81.91,23.33 IC5.21
GND  (via drill 0.6 pad 1.42, 0.6 pad 1.68)
  Top 0.61: v134.93,82.7 v127.63,82.7
  Bottom 0.406: IC5.16 75.56,13.17 | 52.7,41.11 56.51,41.11 57.78,42.38 60.64,42.38 61.91,43.65
  Bottom 0.61: 18.41,27.77 C2.2 16.82,27.46 15.24,25.87 13.65,25.87 12.38,27.14 12.38,32.22 C3.2 17.77,37.62 17.77,46.19 19.68,48.09 | 18.41,27.77 C1.2 | CN1.GND 11.44,58.24 12.06,57.62 12.06,53.49 | 12.06,53.49 12.06,39.84 8.57,36.35 8.57,25.23 11.74,22.06 30.47,22.06 C6.1 31.74,24.6 | 31.74,24.6 C5.1 30.16,27.46 JP4.1 | IC1.20 41.59,22.06 42.54,23.01 42.54,24.92 41.59,25.87 37.46,25.87 36.19,24.6 v35.87,24.6 31.74,24.6 | 12.06,53.49 31.74,53.49 32.7,52.54 32.7,49.68 31.74,48.73 23.17,48.73 22.54,48.09 U$6.1 19.68,48.09 | v18.41,32.22 18.41,27.77 | C4.2 19.68,48.09 | 22.86,73.5 22.86,71.91 31.11,63.65 C8.1 | 61.91,43.65 IC3.10 | v134.93,82.7 140.33,76.03 144.46,76.03 C17.2 | v127.63,82.7 125.09,82.7
  Bottom 0.813: 61.91,43.65 58.1,47.46 IC1.31 | 58.73,89.69 R28.1 53.02,89.69 R25.3 | 58.73,89.69 R22.1 T2.E | 70.48,80.16 71.43,79.21 100.32,79.21 104.13,83.02 JS2.1 JS2.3 JS2.5 JS2.7 JS2.9 JS2.11 121.91,78.58 121.91,65.88 R11.2 | 66.67,13.17 IC3.1 | 66.67,13.17 IC5.16 | 49.53,13.17 47.62,13.17 45.08,15.71 40,15.71 | 49.53,13.17 66.67,13.17 | 70.48,80.16 GND.MP | 70.48,80.16 58.73,80.16 | 58.73,80.16 44.13,80.16 37.46,73.5 33.02,73.5 | 40,15.71 40,9.36 43.81,5.55 110.17,5.55 126.99,22.38 IC6.2 | T4.1 33.02,77.3 33.02,73.5 | 119.38,63.02 C13.- C12.2 C11.2 | 52.7,41.11 C7.1 49.53,13.17 | 40,15.71 IC1.20 | C15.- 22.86,79.21 | 22.86,79.21 22.86,73.5 33.02,73.5 | T3.1 22.86,79.21 | 124.14,93.18 122.87,91.91 122.87,90.64 | 122.87,90.64 122.87,84.92 125.09,82.7 | R17.1 122.87,90.64 | 58.73,89.69 58.73,80.16 | U$7.RING_SW 140.17,89.53 142.66,92.01 U$7.RING
  pour Bottom (isolate 1.016, no thermals): -0.64,100.8 160.65,100.8 160.65,-0.8 -0.64,-0.48
N$1
  Bottom 0.406: IC1.32 R8.1
N$2
  Bottom 0.406: IC1.33 R7.1
N$3
  Bottom 0.406: IC1.34 R6.1
N$4
  Bottom 0.406: IC1.35 R5.1
N$5
  Bottom 0.406: IC1.36 R4.1
N$6
  Bottom 0.406: IC1.37 R3.1
N$7
  Bottom 0.406: IC1.38 R2.1
N$8
  Bottom 0.406: IC1.39 R1.1
N$9
  Bottom 0.406: IC3.11 52.7,43.65 43.81,52.54 IC1.8
N$10
  Bottom 0.61: IC1.10 JP4.5 23.81,47.46 23.17,46.82 U$6.2
N$11
  Bottom 0.61: IC1.11 JP4.4 23.81,44.92 23.17,45.55 U$6.3
N$12
  Bottom 0.61: U$6.5 23.17,43.02 23.81,43.65 41.59,43.65 42.22,44.28 42.22,48.09 41.59,48.73 35.24,48.73 34.29,49.68 R32.2 33.33,54.76 14.28,54.76 13.65,55.4 13.65,59.21 13.01,59.84 CN1.D+
N$13  (via drill 0.6 pad 1.27)
  Top 0.61: v25.39,41.74 v10.16,41.74
  Bottom 0.61: U$6.6 v25.39,41.74 | v10.16,41.74 8.25,41.74 6.98,43.02 6.98,57.62 6.34,58.25 6.34,59.84 7.14,60.64 CN1.D-
N$14  (1 unrouted)
  Bottom 0.61: C2.1 14.28,30.63 Y1.2 18.09,34.44 20.95,34.44 21.58,35.08 21.58,39.2
N$15  (1 unrouted)
  Bottom 0.61: 22.54,32.22 24.12,33.81 24.12,39.2 22.86,40.48 21.58,40.48 | Y1.1 22.54,32.22 | 22.54,32.22 C1.1
N$16
  Bottom 0.61: U$6.4 19.68,44.28 19.04,43.65 19.04,37.62 C3.1
N$17
  Bottom 0.406: R33.1 116.2,86.83 JS2.12
N$18
  Bottom 0.813: IC2.3 129.85,39.84 135.88,45.87 140.97,45.87 145.09,41.74 | C10.+ 145.09,41.74 | 145.09,41.74 D8.C
N$19
  Bottom 0.406: R10.1 59.69,77.62 60.64,78.58 66.03,78.58 67.3,77.3 96.2,77.3 97.15,76.35 RT.K
N$20
  Bottom 0.61: IC4.5 C16.1
N$21
  Bottom 0.61: IC4.3 136.2,74.77 138.74,72.22 138.74,69.37 | 138.74,69.37 144.46,69.37 145.41,68.41 Q1.2 | Q2.2 137.16,68.41 138.11,69.37 138.74,69.37
N$22
  Bottom 0.61: IC4.2 136.2,77.3 138.74,74.77 IC4.6 147,74.77 148.27,76.03 C17.1 148.27,77.94 148.9,78.58 R34.2
N$23  (1 unrouted)
  Bottom 0.813: D2.C 138.42,50.32 D1.A
N$24
  Bottom 0.813: Q1.3 141.28,66.19 | 141.28,66.19 141.28,59.52 | 141.28,59.52 C19.- | 141.28,59.52 C9.- | 141.28,66.19 Q2.3
N$25
  Bottom 0.813: C9.+ 148.59,54.13 | D1.C 148.59,54.13 | D8.A 145.09,50 148.59,53.49 148.59,54.13
N$26
  Bottom 0.406: R11.1 GN.K
N$27
  Bottom 0.406: JS4.5 JS4.3 JS4.1 103.82,66.51 100.01,62.7 90.8,62.7 81.91,53.81 81.91,50 78.1,46.19 IC5.3
N$28
  Bottom 0.61: C5.2 33.02,27.14 Y2.2 IC1.18
N$29
  Bottom 0.61: C6.2 34.6,20.79 Y2.1 38.41,24.6 IC1.19
N$30
  Bottom 0.406: IC5.1 90.8,65.24 99.69,65.24 100.96,66.51 100.96,70.95 104.13,74.13 JS3.1 JS3.3 JS3.5
N$31
  Bottom 0.406: IC5.24 89.53,30.95 84.45,36.03 84.45,52.54 90.8,58.89 JS5.1 JS5.3
N$32
  Bottom 0.406: R9.1 37.46,52.22 39.68,50 IC1.9 42.54,50 46.98,45.55 C7.2
N$34
  Bottom 0.406: IC5.25 89.53,33.49 85.72,37.3 85.72,51.91 89.53,55.71 100.32,55.71 JS6.1 JS6.3 JS6.5
N$35
  Bottom 0.406: R12.1 90.8,89.37 92.39,87.78 99.37,87.78 101.59,85.56 JS2.2
N$36
  Bottom 0.406: R13.1 98.42,90.64 101.91,87.15 105.72,87.15 JS2.4
N$37
  Bottom 0.406: 106.04,43.65 106.04,46.82 99.69,53.17 90.8,53.17 88.26,50.63 88.26,43.65 90.8,41.11 IC5.28 | 106.04,43.65 JS7.1 | 106.04,43.65 JS7.3
N$38
  Bottom 0.406: IC5.29 90.8,43.65 89.53,44.92 89.53,48.73 90.8,50 98.42,50 103.5,44.92 103.5,37.3 JS8.1 JS8.3
N$41
  Bottom 0.406: IC1.1 40,73.18 R10.2
N$42
  Bottom 0.406: 106.04,28.41 106.04,22.06 108.58,22.06 108.58,19.52 102.86,19.52 99.69,22.7 99.69,43.65 97.15,46.19 IC5.30 | 106.04,28.41 JS9.1 | 106.04,28.41 JS9.3 JS9.5
N$43  (via drill 0.61)
  other vias: 126.96,13.17
N$44
  Bottom 0.406: R14.1 103.18,88.42 106.99,88.42 JS2.6
N$45
  Bottom 0.406: IC5.31 97.15,48.73 100.96,44.92 100.96,23.33 103.5,20.79 JS10.1 JS10.3
N$47
  Bottom 0.406: R15.1 107.31,90.64 JS2.8
N$48
  Bottom 0.406: R16.1 111.12,89.37 JS2.10
N$49
  Bottom 0.406: R18.1 125.72,59.84 | R31.1 125.72,59.84 | 125.72,59.84 125.72,79.21 120.64,84.29 120.64,87.78 119.69,88.73 119.69,91.59 R17.2 R17.3 R33.3 | R16.3 R15.3 | R15.3 R14.3 | R14.3 R13.3 | R13.3 R12.3 R12.2 | R13.3 R13.2 | R14.3 R14.2 | R15.3 R15.2 | R16.3 R16.2 | R33.3 R16.3 | R33.2 R33.3
N$50
  Bottom 0.406: JS1.5 JS1.3 JS1.1 D10.A
N$51
  Bottom 0.406: D9.A T1.C
N$52
  Bottom 0.406: R27.2 R26.1 T5.2
N$53
  Bottom 0.406: T4.3 R27.1
N$54  (via drill 0.61)
  other vias: 142.87,12.85
N$55
  Bottom 0.406: R24.2 R24.3 34.29,92.55 49.21,92.55 | 49.21,92.55 51.11,94.45 R23.1 57.78,96.99 145.09,96.99 157.16,84.92 157.16,37.3 147.63,27.77 IC7.1 | 49.21,92.55 49.21,88.1 50.48,86.83 R25.2 R25.1
N$56
  Bottom 0.406: T3.3 R24.1
N$57
  Bottom 0.813: R26.2 37.14,85.56 34.6,85.56 | T5.1 45.72,91.28 36.19,91.28 34.6,89.69 34.6,85.56 | R23.2 25.39,94.45 | 25.39,94.45 16.5,94.45 1.9,79.84 1.9,20.47 19.36,3.01 128.58,3.01 134.93,9.36 134.93,17.61 142.87,25.55 IC7.2 | 25.39,94.45 C15.+ 26.66,85.56 34.6,85.56
N$58  (via drill 0.61)
  other vias: 5.63,95.47
N$59  (via drill 0.61)
  other vias: 5.63,5.47
N$60
  Bottom 0.406: R29.2 T4.2
N$61
  Bottom 0.406: 86.67,91.91 R19.2 | 86.67,91.91 T1.E | R18.2 121.91,52.22 | 86.67,91.91 117.15,91.91 118.1,90.96 118.1,87.78 119.38,86.51 119.38,83.66 124.14,78.89 124.14,64.29 121.91,62.06 121.91,52.22 | 121.91,52.22 C13.+ 121.28,49.68 121.28,43.33 122.23,42.38 IC2.2
N$62
  Bottom 0.406: R30.2 T3.2
N$63  (via drill 0.61)
  other vias: 155.63,5.47
N$64  (via drill 0.61)
  other vias: 155.63,95.47
N$65  (1 unrouted)
  Bottom 0.813: D4.C 131.44,60.16 132.07,59.52 C19.+
N$68
  Bottom 0.406: R20.2 82.55,95.08 | 82.55,95.08 R19.1 | T1.B 82.55,95.08
N$69
  Bottom 0.406: T2.C 69.84,87.47 R20.1
N$70
  Bottom 0.406: R21.2 63.81,85.24 T2.B
N$71
  Bottom 0.406: R31.2 126.99,50.32 124.14,47.46 IC2.1
RTS
  Bottom 0.61: U$6.14 13.33,45.55 | 13.33,45.55 13.33,51.27 14.28,52.22 26.98,52.22 JP4.6 | 13.33,45.55 13.33,39.2 9.84,35.71 9.84,25.87 12.38,23.33 23.49,23.33 26.66,26.5 26.66,37.62 27.62,38.57 37.78,38.57 39.05,39.84 IC1.13
UXX  (via drill 0.61)
  Top 0.406: v102.23,48.73 v102.23,43.65 | v99.69,80.8 v99.69,51.27
  Bottom 0.406: IC5.32 v99.69,51.27 v102.23,48.73 JS7.2 | 54.92,82.07 47.62,82.07 46.35,83.34 T5.3 | 54.92,82.07 R28.2 | JS9.2 102.23,33.49 v102.23,43.65 | v99.69,80.8 85.4,80.8 83.18,83.02 83.18,85.56 | 54.92,82.07 54.92,86.83 53.65,88.1 51.75,88.1 51.11,88.73 51.11,90.32 52.7,91.91 62.86,91.91 63.81,92.86 UXX.MP 70.48,90.96 72.07,89.37 81.91,89.37 83.18,88.1 83.18,85.56 | JS1.2 83.18,85.56
VCC_5/6
  Bottom 0.406: R30.1 32.38,65.24 IC1.3 43.81,65.24 JP2.2
VCC_EIN
  Bottom 0.406: R29.1 IC1.2 42.54,67.78 JP1.2
VPP  (via drill 0.61)
  Top 0.406: v66.67,71.59 v66.67,82.7
  Bottom 0.406: JS4.2 106.04,67.78 108.58,67.78 | 108.58,67.78 111.12,67.78 111.12,65.24 JS5.4 108.58,60.16 108.58,52.54 106.04,52.54 JS6.2 | 108.58,67.78 108.58,70.32 111.12,72.86 111.12,75.4 108.58,75.4 108.58,77.94 106.04,77.94 JS3.2 102.86,76.67 97.78,71.59 VPP.MP v66.67,71.59
  Bottom 0.813: R22.2 66.03,82.07 v66.67,82.7 68.26,84.29 D9.C 75.56,83.02 D10.C
VPP_EIN
  Bottom 0.406: IC1.4 45.08,62.7 JP3.2 47.62,65.24 47.62,72.86 50.48,75.72 62.86,75.72 R21.1

### Text on the board
Top: 29 Brücken
Bottom: EPROM-Programmer | HR ET LAB | http://www.hsch.at | http://s-huehn.de
Dimension: Die 3 Brücken unter dem TEXTOOL-Sockel werden auf der Lötseite bestückt. | Schaltung von Scott-Falk Hühn | Layout von H. Schönbauer
tPlace: 12V | 12,5V | 12.75V | 13V | 21,1V | 25,1V
tNames: R1 | R2 | R3 | R4 | R5